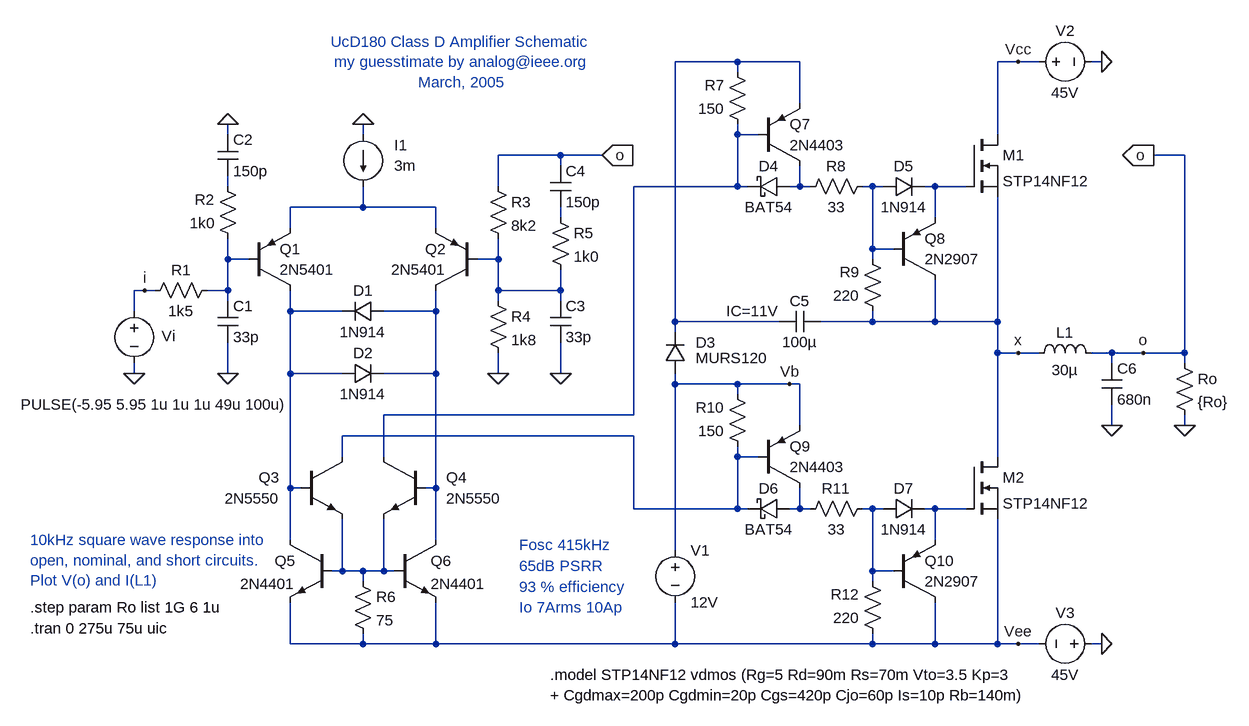
[diagram p0: schematic ClassD_UcD180.asc]
ClassD_UcD180.asc, the LTspice schematic file:
Version 4
SHEET 1 1328 1060
WIRE -896 128 -896 96
WIRE -896 224 -896 208
WIRE -880 96 -896 96
WIRE -864 96 -880 96
WIRE -752 -144 -752 -160
WIRE -752 -64 -752 -80
WIRE -752 48 -752 16
WIRE -752 96 -784 96
WIRE -752 96 -752 48
WIRE -752 112 -752 96
WIRE -752 224 -752 176
WIRE -720 48 -752 48
WIRE -656 0 -656 -32
WIRE -656 128 -656 96
WIRE -656 224 -656 128
WIRE -656 400 -656 224
WIRE -656 480 -656 400
WIRE -656 640 -656 576
WIRE -640 400 -656 400
WIRE -576 128 -656 128
WIRE -576 224 -656 224
WIRE -576 352 -576 320
WIRE -576 528 -592 528
WIRE -576 528 -576 448
WIRE -544 -144 -544 -160
WIRE -544 -32 -656 -32
WIRE -544 -32 -544 -64
WIRE -544 528 -576 528
WIRE -544 544 -544 528
WIRE -544 640 -656 640
WIRE -544 640 -544 624
WIRE -512 352 -512 288
WIRE -512 528 -544 528
WIRE -512 528 -512 448
WIRE -496 528 -512 528
WIRE -432 -32 -544 -32
WIRE -432 0 -432 -32
WIRE -432 128 -512 128
WIRE -432 128 -432 96
WIRE -432 224 -512 224
WIRE -432 224 -432 128
WIRE -432 400 -448 400
WIRE -432 400 -432 224
WIRE -432 480 -432 400
WIRE -432 640 -544 640
WIRE -432 640 -432 576
WIRE -336 -64 -336 -112
WIRE -336 48 -368 48
WIRE -336 48 -336 16
WIRE -336 96 -336 48
WIRE -336 112 -336 96
WIRE -336 224 -336 192
WIRE -240 -112 -336 -112
WIRE -240 -96 -240 -112
WIRE -240 -16 -240 -32
WIRE -240 96 -336 96
WIRE -240 96 -240 64
WIRE -240 112 -240 96
WIRE -240 224 -240 176
WIRE -176 -112 -240 -112
WIRE -128 288 -512 288
WIRE -128 288 -128 -64
WIRE -128 320 -576 320
WIRE -128 432 -128 320
WIRE -64 144 -64 -256
WIRE -64 160 -64 144
WIRE -64 240 -64 224
WIRE -64 496 -64 240
WIRE -64 640 -432 640
WIRE -64 640 -64 576
WIRE 32 -256 -64 -256
WIRE 32 -240 32 -256
WIRE 32 -144 32 -160
WIRE 32 -64 -128 -64
WIRE 32 -64 32 -144
WIRE 32 240 -64 240
WIRE 32 256 32 240
WIRE 32 352 32 336
WIRE 32 432 -128 432
WIRE 32 432 32 352
WIRE 48 -64 32 -64
WIRE 48 432 32 432
WIRE 64 -144 32 -144
WIRE 64 352 32 352
WIRE 96 144 -64 144
WIRE 112 240 32 240
WIRE 128 -256 32 -256
WIRE 128 -192 128 -256
WIRE 128 -64 112 -64
WIRE 128 -64 128 -96
WIRE 128 240 112 240
WIRE 128 304 128 240
WIRE 128 432 112 432
WIRE 128 432 128 400
WIRE 144 -64 128 -64
WIRE 144 432 128 432
WIRE 240 -64 224 -64
WIRE 240 32 240 -64
WIRE 240 48 240 32
WIRE 240 144 160 144
WIRE 240 144 240 128
WIRE 240 432 224 432
WIRE 240 528 240 432
WIRE 240 544 240 528
WIRE 240 640 -64 640
WIRE 240 640 240 624
WIRE 256 -64 240 -64
WIRE 256 432 240 432
WIRE 272 32 240 32
WIRE 272 528 240 528
WIRE 336 -64 320 -64
WIRE 336 -16 336 -64
WIRE 336 144 240 144
WIRE 336 144 336 80
WIRE 336 432 320 432
WIRE 336 480 336 432
WIRE 336 640 240 640
WIRE 336 640 336 576
WIRE 384 -64 336 -64
WIRE 384 432 336 432
WIRE 432 -144 432 -256
WIRE 432 144 336 144
WIRE 432 144 432 -48
WIRE 432 192 432 144
WIRE 432 352 432 192
WIRE 432 640 336 640
WIRE 432 640 432 448
WIRE 464 -256 432 -256
WIRE 464 192 432 192
WIRE 464 640 432 640
WIRE 496 -256 464 -256
WIRE 496 192 464 192
WIRE 496 640 464 640
WIRE 592 -256 576 -256
WIRE 592 640 576 640
WIRE 608 192 576 192
WIRE 608 208 608 192
WIRE 608 304 608 272
WIRE 656 192 608 192
WIRE 720 -112 672 -112
WIRE 720 192 656 192
WIRE 720 192 720 -112
WIRE 720 208 720 192
WIRE 720 304 720 288
FLAG 608 304 0
FLAG 720 304 0
FLAG 592 640 0
FLAG 592 -256 0
FLAG 464 -256 Vcc
FLAG 464 640 Vee
FLAG 112 240 Vb
FLAG -896 224 0
FLAG -336 224 0
FLAG -176 -112 o
IOPIN -176 -112 In
FLAG 672 -112 o
IOPIN 672 -112 Out
FLAG -544 -160 0
FLAG -240 224 0
FLAG 464 192 x
FLAG -752 224 0
FLAG -752 -160 0
FLAG -880 96 i
FLAG 656 192 o
SYMBOL npn -496 480 R0
SYMATTR InstName Q6
SYMATTR Value 2N4401
SYMBOL npn -592 480 M0
SYMATTR InstName Q5
SYMATTR Value 2N4401
SYMBOL pnp 272 80 M180
WINDOW 0 48 64 Left 0
WINDOW 3 48 32 Left 0
SYMATTR InstName Q8
SYMATTR Value 2N2907
SYMBOL diode 256 -48 R270
WINDOW 0 32 32 VTop 0
WINDOW 3 0 32 VBottom 0
SYMATTR InstName D5
SYMATTR Value 1N914
SYMBOL pnp 64 -96 M180
WINDOW 0 48 64 Left 0
WINDOW 3 48 32 Left 0
SYMATTR InstName Q7
SYMATTR Value 2N4403
SYMBOL res 256 144 R180
WINDOW 0 36 76 Left 0
WINDOW 3 36 40 Left 0
SYMATTR InstName R9
SYMATTR Value 220
SYMBOL voltage -64 480 R0
SYMATTR InstName V1
SYMATTR Value 12V
SYMBOL cap 96 160 R270
WINDOW 0 32 32 VTop 0
WINDOW 3 0 32 VBottom 0
WINDOW 123 32 0 VLeft 0
SYMATTR InstName C5
SYMATTR Value 100µ
SYMATTR Value2 IC=11V
SYMBOL diode -80 224 M180
WINDOW 0 48 48 Left 0
WINDOW 3 48 24 Left 0
SYMATTR InstName D3
SYMATTR Value MURS120
SYMBOL voltage 592 640 R90
WINDOW 0 -32 56 VBottom 0
WINDOW 3 32 56 VTop 0
SYMATTR InstName V3
SYMATTR Value 45V
SYMBOL voltage 480 -256 R270
WINDOW 0 32 56 VTop 0
WINDOW 3 -32 56 VBottom 0
SYMATTR InstName V2
SYMATTR Value 45V
SYMBOL ind 480 208 R270
WINDOW 0 32 56 VTop 0
WINDOW 3 5 56 VBottom 0
SYMATTR InstName L1
SYMATTR Value 30µ
SYMATTR SpiceLine Rser=10m Rpar=10k
SYMBOL cap 592 208 R0
SYMATTR InstName C6
SYMATTR Value 680n
SYMBOL res 704 192 R0
SYMATTR InstName Ro
SYMATTR Value {Ro}
SYMBOL npn -448 352 M0
WINDOW 0 -32 32 Right 0
WINDOW 3 -32 64 Right 0
SYMATTR InstName Q4
SYMATTR Value 2N5550
SYMBOL npn -640 352 R0
WINDOW 0 -32 32 Right 0
WINDOW 3 -32 64 Right 0
SYMATTR InstName Q3
SYMATTR Value 2N5550
SYMBOL res -560 528 R0
SYMATTR InstName R6
SYMATTR Value 75
SYMBOL res -352 96 R0
SYMATTR InstName R4
SYMATTR Value 1k8
SYMBOL res -352 -80 R0
SYMATTR InstName R3
SYMATTR Value 8k2
SYMBOL res -256 -32 R0
SYMATTR InstName R5
SYMATTR Value 1k0
SYMBOL res 240 -80 R90
WINDOW 0 0 56 VBottom 0
WINDOW 3 32 56 VTop 0
SYMATTR InstName R8
SYMATTR Value 33
SYMBOL res 48 -144 R180
WINDOW 0 36 76 Left 0
WINDOW 3 36 40 Left 0
SYMATTR InstName R7
SYMATTR Value 150
SYMBOL schottky 112 -48 M270
WINDOW 0 32 32 VTop 0
WINDOW 3 0 32 VBottom 0
SYMATTR InstName D4
SYMATTR Value BAT54
SYMATTR Description Diode
SYMATTR Type diode
SYMBOL nmos 384 -144 R0
SYMATTR InstName M1
SYMATTR Value STP14NF12
SYMBOL pnp 272 576 M180
WINDOW 0 48 64 Left 0
WINDOW 3 48 32 Left 0
SYMATTR InstName Q10
SYMATTR Value 2N2907
SYMBOL diode 256 448 R270
WINDOW 0 32 32 VTop 0
WINDOW 3 0 32 VBottom 0
SYMATTR InstName D7
SYMATTR Value 1N914
SYMBOL pnp 64 400 M180
WINDOW 0 48 64 Left 0
WINDOW 3 48 32 Left 0
SYMATTR InstName Q9
SYMATTR Value 2N4403
SYMBOL res 256 640 R180
WINDOW 0 36 76 Left 0
WINDOW 3 36 40 Left 0
SYMATTR InstName R12
SYMATTR Value 220
SYMBOL res 240 416 R90
WINDOW 0 0 56 VBottom 0
WINDOW 3 32 56 VTop 0
SYMATTR InstName R11
SYMATTR Value 33
SYMBOL res 48 352 R180
WINDOW 0 36 76 Left 0
WINDOW 3 36 40 Left 0
SYMATTR InstName R10
SYMATTR Value 150
SYMBOL pnp -720 96 M180
WINDOW 0 48 64 Left 0
WINDOW 3 48 32 Left 0
SYMATTR InstName Q1
SYMATTR Value 2N5401
SYMBOL pnp -368 96 R180
WINDOW 0 48 64 Left 0
WINDOW 3 48 32 Left 0
SYMATTR InstName Q2
SYMATTR Value 2N5401
SYMBOL diode -512 144 M270
WINDOW 0 32 32 VTop 0
WINDOW 3 0 32 VBottom 0
SYMATTR InstName D1
SYMATTR Value 1N914
SYMBOL diode -576 240 R270
WINDOW 0 32 32 VTop 0
WINDOW 3 0 32 VBottom 0
SYMATTR InstName D2
SYMATTR Value 1N914
SYMBOL current -544 -144 R0
WINDOW 0 48 16 Left 0
WINDOW 3 48 48 Left 0
SYMATTR InstName I1
SYMATTR Value 3m
SYMBOL schottky 112 448 M270
WINDOW 0 32 32 VTop 0
WINDOW 3 0 32 VBottom 0
SYMATTR InstName D6
SYMATTR Value BAT54
SYMATTR Description Diode
SYMATTR Type diode
SYMBOL voltage -896 112 R0
WINDOW 0 53 70 Bottom 0
WINDOW 3 32 144 Top 0
WINDOW 123 0 0 Left 0
WINDOW 39 60 56 VTop 0
SYMATTR InstName Vi
SYMATTR Value PULSE(-5.95 5.95 1u 1u 1u 49u 100u)
SYMBOL cap -256 -96 R0
SYMATTR InstName C4
SYMATTR Value 150p
SYMBOL cap -256 112 R0
SYMATTR InstName C3
SYMATTR Value 33p
SYMBOL res -768 80 R90
WINDOW 0 0 56 VBottom 0
WINDOW 3 32 56 VTop 0
SYMATTR InstName R1
SYMATTR Value 1k5
SYMBOL res -736 32 R180
WINDOW 0 36 76 Left 0
WINDOW 3 36 40 Left 0
SYMATTR InstName R2
SYMATTR Value 1k0
SYMBOL cap -768 -144 R0
SYMATTR InstName C2
SYMATTR Value 150p
SYMBOL cap -768 112 R0
SYMATTR InstName C1
SYMATTR Value 33p
SYMBOL nmos 384 352 R0
SYMATTR InstName M2
SYMATTR Value STP14NF12
TEXT -1056 616 Left 0 !.tran 0 275u 75u uic
TEXT -256 688 Left 0 !.model STP14NF12 vdmos (Rg=5 Rd=90m Rs=70m Vto=3.5 Kp=3\n+ Cgdmax=200p Cgdmin=20p Cgs=420p Cjo=60p Is=10p Rb=140m)
TEXT -304 584 Left 0 ;Io 7Arms 10Ap
TEXT -304 520 Left 0 ;65dB PSRR
TEXT -304 552 Left 0 ;93 % efficiency
TEXT -392 -256 Center 0 ;UcD180 Class D Amplifier Schematic \nmy guesstimate by analog@ieee.org\nMarch, 2005
TEXT -304 488 Left 0 ;Fosc 415kHz
TEXT -1056 584 Left 0 !.step param Ro list 1G 6 1u
TEXT -1056 480 Left 0 ;10kHz square wave response into\nopen, nominal, and short circuits.\nPlot V(o) and I(L1)

The netlist it stands for:
* ClassD_UcD180.asc
Q6 N008 N006 Vee 0 2N4401
Q5 N004 N006 Vee 0 2N4401
Q8 x N014 N016 0 2N2907
D5 N014 N016 1N914
Q7 N012 N007 N011 0 2N4403
R9 x N014 220
V1 Vb Vee 12V
C5 N011 x 100µ IC=11V
D3 Vb N011 MURS120
V3 0 Vee 45V
V2 Vcc 0 45V
L1 x o 30µ Rser=10m Rpar=10k
C6 o 0 680n
Ro o 0 {Ro}
Q4 N007 N008 N006 0 2N5550
Q3 N005 N004 N006 0 2N5550
R6 N006 Vee 75
R4 N009 0 1k8
R3 o N009 8k2
R5 N010 N009 1k0
R8 N014 N012 33
R7 N007 N011 150
D4 N012 N007 BAT54
M1 Vcc N016 x x STP14NF12
Q10 Vee N015 N017 0 2N2907
D7 N015 N017 1N914
Q9 N013 N005 Vb 0 2N4403
R12 Vee N015 220
R11 N015 N013 33
R10 N005 Vb 150
Q1 N004 N002 N003 0 2N5401
Q2 N008 N009 N003 0 2N5401
D1 N008 N004 1N914
D2 N004 N008 1N914
I1 0 N003 3m
D6 N013 N005 BAT54
Vi i 0 PULSE(-5.95 5.95 1u 1u 1u 49u 100u)
C4 o N010 150p
C3 N009 0 33p
R1 N002 i 1k5
R2 N002 N001 1k0
C2 0 N001 150p
C1 N002 0 33p
M2 x N017 Vee Vee STP14NF12
.model D D
.lib standard.dio
.model NPN NPN
.model PNP PNP
.lib standard.bjt
.model NMOS NMOS
.model PMOS PMOS
.lib standard.mos
.tran 0 275u 75u uic
.model STP14NF12 vdmos (Rg=5 Rd=90m Rs=70m Vto=3.5 Kp=3
+ Cgdmax=200p Cgdmin=20p Cgs=420p Cjo=60p Is=10p Rb=140m)
* Io 7Arms 10Ap
* 65dB PSRR
* 93 % efficiency
* UcD180 Class D Amplifier Schematic
* my guesstimate by analog@ieee.org
* March, 2005
* Fosc 415kHz
.step param Ro list 1G 6 1u
* 10kHz square wave response into
* open, nominal, and short circuits.
* Plot V(o) and I(L1)
.backanno
.end